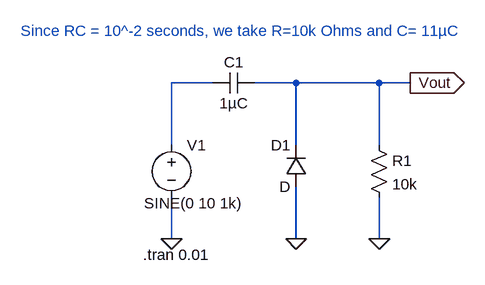
[diagram p0: schematic Draft4.asc]
Draft4.asc, the LTspice schematic file:
Version 4
SHEET 1 880 680
WIRE 160 48 96 48
WIRE 288 48 224 48
WIRE 416 48 288 48
WIRE 464 48 416 48
WIRE 96 144 96 48
WIRE 288 144 288 48
WIRE 416 144 416 48
WIRE 96 288 96 224
WIRE 288 288 288 208
WIRE 416 288 416 224
FLAG 96 288 0
FLAG 288 288 0
FLAG 416 288 0
FLAG 464 48 Vout
IOPIN 464 48 Out
SYMBOL voltage 96 128 R0
WINDOW 3 -42 105 Left 2
WINDOW 123 0 0 Left 0
WINDOW 39 0 0 Left 0
SYMATTR InstName V1
SYMATTR Value SINE(0 10 1k)
SYMBOL cap 224 32 R90
WINDOW 0 0 32 VBottom 2
WINDOW 3 32 32 VTop 2
SYMATTR InstName C1
SYMATTR Value 1µC
SYMBOL res 400 128 R0
SYMATTR InstName R1
SYMATTR Value 10k
SYMBOL diode 304 208 R180
WINDOW 0 24 64 Left 2
WINDOW 3 24 0 Left 2
SYMATTR InstName D1
TEXT 52 312 Left 2 !.tran 0.01
TEXT -136 -32 Left 2 ;Since RC = 10^-2 seconds, we take R=10k Ohms and C= 11µC

The netlist it stands for:
* Draft4.asc
V1 N001 0 SINE(0 10 1k)
C1 Vout N001 1µC
R1 Vout 0 10k
D1 0 Vout D
.model D D
.lib standard.dio
.tran 0.01
* Since RC = 10^-2 seconds, we take R=10k Ohms and C= 11µC
.backanno
.end